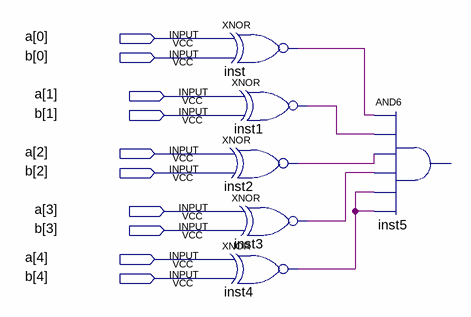
[diagram p0: schematic sheet]
// Quartus schematic compare5bit.bdf as structural Verilog: 6 symbols, 10 pins
module compare5bit (
  input  [4:0] a,
  input  [4:0] b
);

  wire inst1_out, inst2_out, inst3_out, inst4_out, inst_out;

  xnor inst (inst_out, a[0], b[0]);
  xnor inst1 (inst1_out, a[1], b[1]);
  xnor inst2 (inst2_out, a[2], b[2]);
  xnor inst3 (inst3_out, a[3], b[3]);
  xnor inst4 (inst4_out, a[4], b[4]);
  // AND6 inst5 has open pins: IN1=inst_out, IN2=inst1_out, IN3=inst2_out, IN4=inst3_out, IN5=inst4_out, IN6=inst4_out, OUT=open
endmodule
